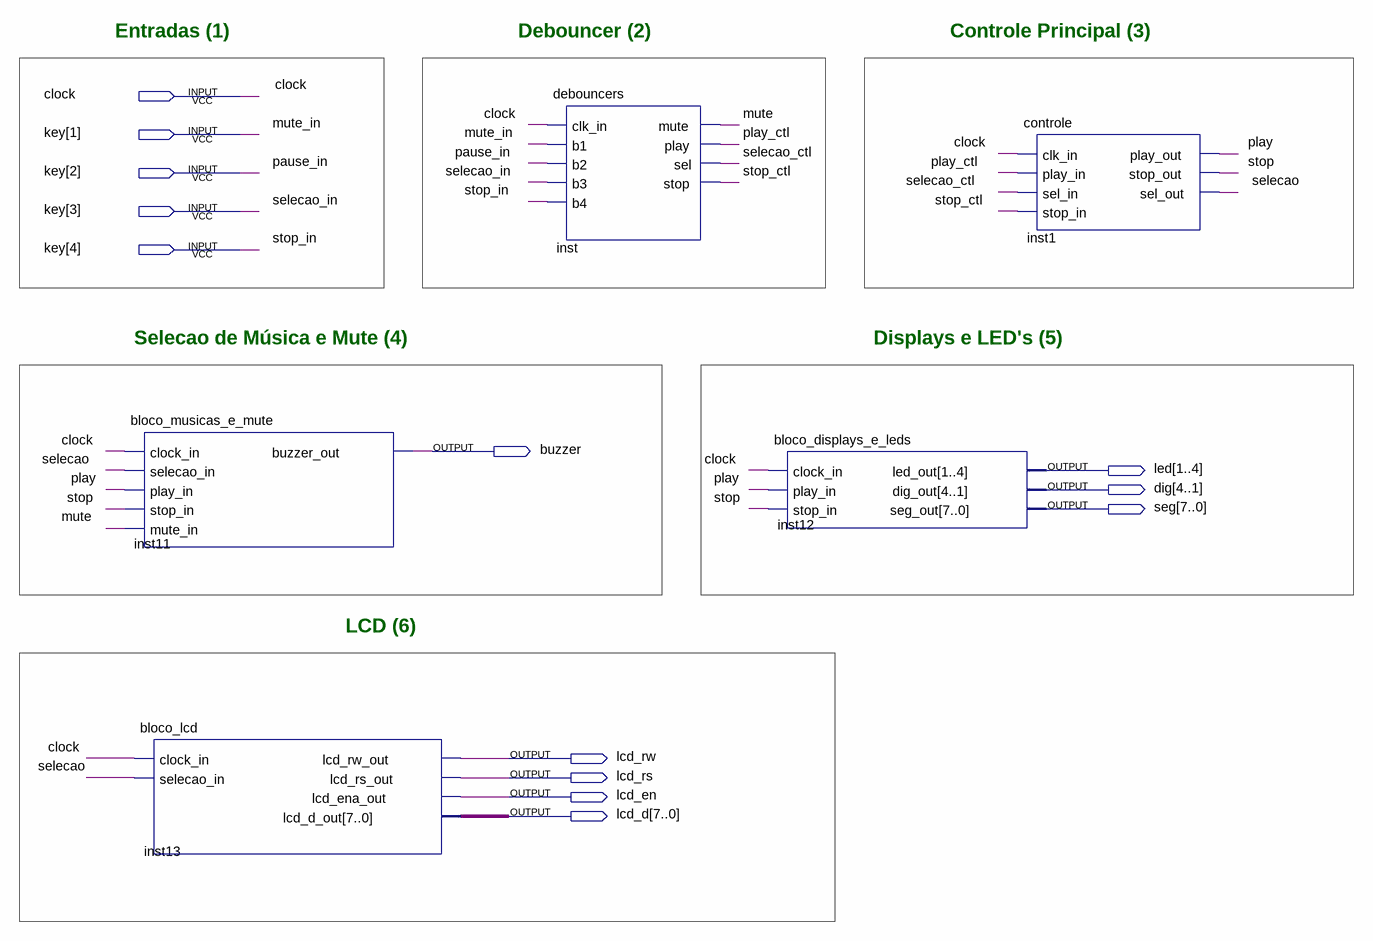
[diagram p0: schematic sheet]
// Quartus schematic music_player_v2.bdf as structural Verilog: 5 symbols, 13 pins
module music_player_v2 (
  input  clock,
  input  [4:1] key,
  output buzzer,
  output [1:4] led,
  output [4:1] dig,
  output [7:0] seg,
  output lcd_rw,
  output lcd_rs,
  output lcd_en,
  output [7:0] lcd_d
);

  wire mute, play, play_ctl, selecao, selecao_ctl, stop, stop_ctl;

  bloco_musicas_e_mute inst11 (
    .clock_in(clock), .selecao_in(selecao), .play_in(play), .stop_in(stop), .mute_in(mute),
    .buzzer_out(buzzer));
  bloco_lcd inst13 (
    .clock_in(clock), .selecao_in(selecao), .lcd_rw_out(lcd_rw), .lcd_rs_out(lcd_rs), .lcd_ena_out(lcd_en),
    .lcd_d_out(lcd_d));
  debouncers inst (
    .clk_in(clock), .b1(key[1]), .b2(key[2]), .b3(key[3]), .b4(key[4]), .mute(mute), .play(play_ctl),
    .sel(selecao_ctl), .stop(stop_ctl));
  bloco_displays_e_leds inst12 (
    .clock_in(clock), .play_in(play), .stop_in(stop), .led_out(led), .dig_out(dig), .seg_out(seg));
  controle inst1 (
    .clk_in(clock), .play_in(play_ctl), .sel_in(selecao_ctl), .stop_in(stop_ctl), .play_out(play),
    .stop_out(stop), .sel_out(selecao));

  // Other names for the same wires on the sheet: mute_in = key[1]; pause_in = key[2]; selecao_in = key[3];
  //   stop_in = key[4]

  // Notes on the sheet:
  //   Entradas (1)
  //   Debouncer (2)
  //   Controle Principal (3)
  //   Selecao de Música e Mute (4)
  //   Displays e LED's (5)
  //   LCD (6)
endmodule
